# Altium schematic sheet Battery-Management.SchDoc
size A3; SheetNumber: 2; SheetTotal: 2
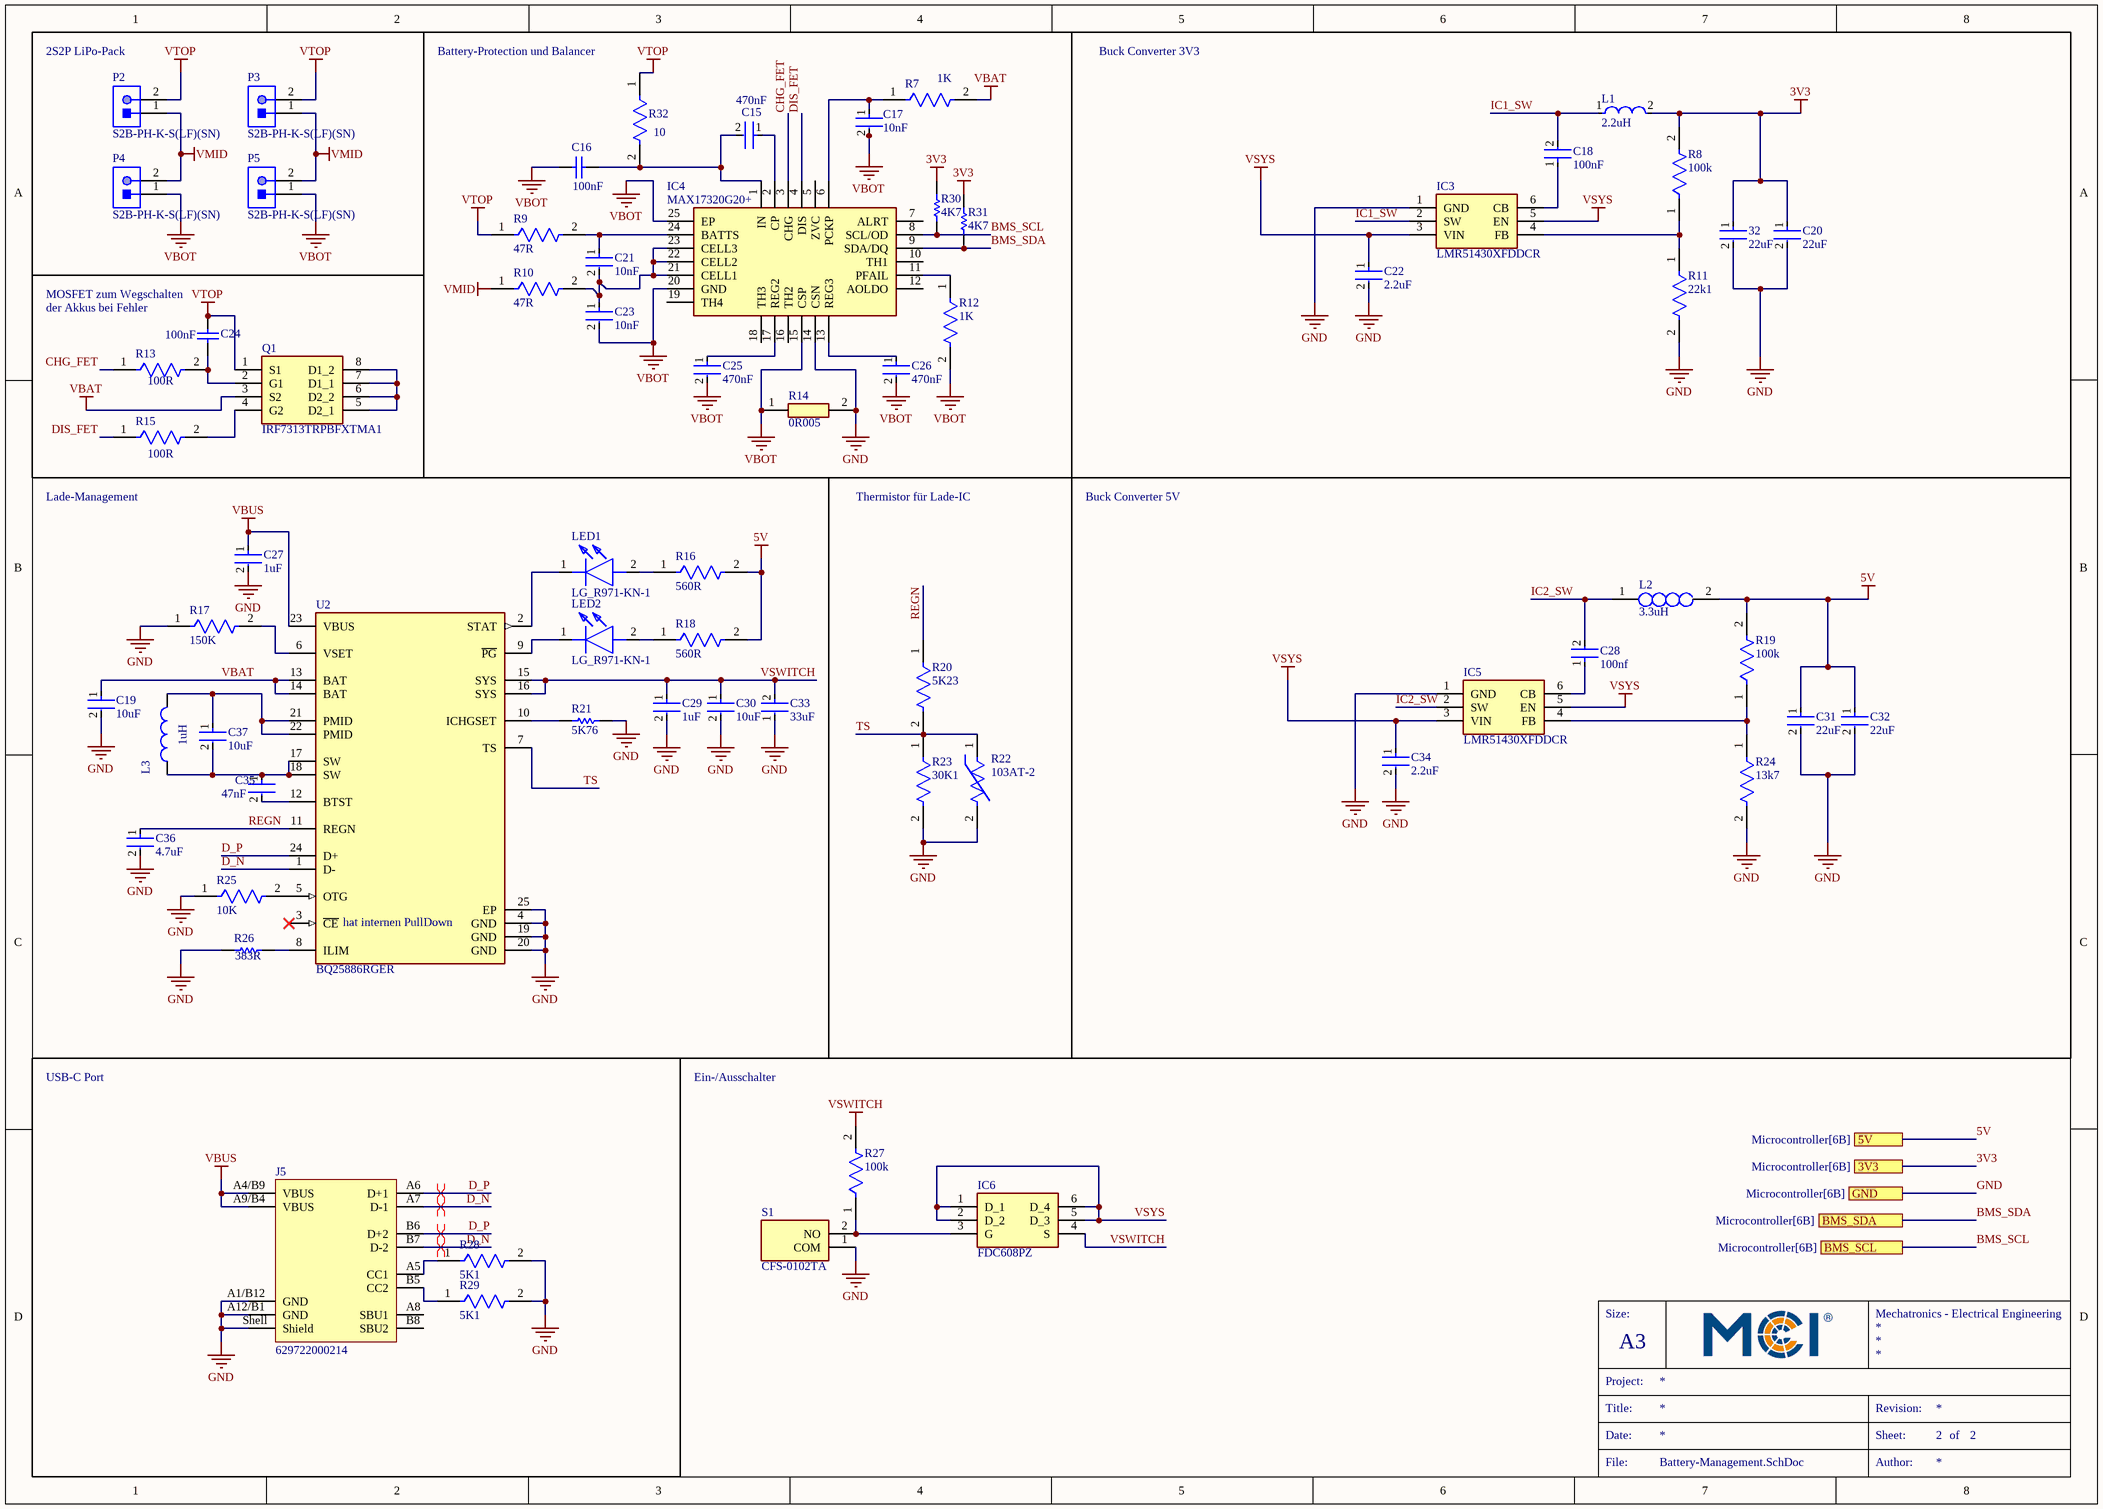
[diagram p0: Battery-Management.SchDoc]

## Parts
32  22uF  [FP-C1210C226K4RACTU-MFG]
C15  470nF  [FP-C0805C-DN-MFG]
C16  100nF  [CAPC2013X145X50LL20T20]
C17  10nF  [FP-AC0805-0_85-MFG]
C18  100nF  [FP-C0805C104M5UACTU-MFG]
C19  10uF  [FP-GRM21B-0_15-IPC_A]
C20  22uF  [FP-C1210C226K4RACTU-MFG]
C21  10nF  [FP-AC0805-0_85-MFG]
C22  2.2uF  [FP-CC1210-G3-MFG]
C23  10nF  [FP-AC0805-0_85-MFG]
C24  100nF  [CAPC2013X145X50LL20T20]
C25  470nF  [FP-C0805C-DN-MFG]
C26  470nF  [FP-C0805C-DN-MFG]
C27  1uF  [FP-CGA4J-MFG]
C28  100nf  [FP-C0805C104M5UACTU-MFG]
C29  1uF  [FP-CGA4J-MFG]
C30  10uF  [FP-C0805C-DG-MFG]
C31  22uF  [FP-C1210C226K4RACTU-MFG]
C32  22uF  [FP-C1210C226K4RACTU-MFG]
C33  33uF  [FP-KRM55Q-6_1_5_3_3_9_1_2-MFG]
C34  2.2uF  [FP-CC1210-G3-MFG]
C35  47nF  [FP-C1206C-EB-MFG]
C36  4.7uF  [FP-C0805C475K3RACAUTO-MFG]
C37  10uF  [FP-GRM21B-0_15-IPC_A]
IC3  LMR51430XFDDCR  [SOT95P280X110-6N]
IC4  MAX17320G20+  [QFN50P400X400X80-25N]
IC5  LMR51430XFDDCR  [SOT95P280X110-6N]
IC6  FDC608PZ  [SOT95P275X110-6N]
J5  629722000214  [629722000214]
L1  2.2uH  [FP-IHLP-2020BZ-FP_1_905x2-MFG]
L2  3.3uH  [INDPM6054X300N]
L3  1uH  [WE-PMFI_322512]
LED1  LG_R971-KN-1  [LEDC2012X80N]
LED2  LG_R971-KN-1  [LEDC2012X80N]
P2  S2B-PH-K-S(LF)(SN)  [JST-S2B-PH-K-S_V]
P3  S2B-PH-K-S(LF)(SN)  [JST-S2B-PH-K-S_V]
P4  S2B-PH-K-S(LF)(SN)  [JST-S2B-PH-K-S_V]
P5  S2B-PH-K-S(LF)(SN)  [JST-S2B-PH-K-S_V]
Q1  IRF7313TRPBFXTMA1  [SOIC127P600X175-8N]
R7  1K  [FP-PCAN0805-MFG]
R8  100k  [FP-RQ73C2A-IPC_B]
R9  47R  [FP-CRGP1206-IPC_C]
R10  47R  [FP-CRGP1206-IPC_C]
R11  22k1  [FP-RT0805-MFG]
R12  1K  [FP-PCAN0805-MFG]
R13  100R  [FP-RN73R2A-IPC_A]
R14  0R005  [RESC7146X175N]
R15  100R  [FP-RN73R2A-IPC_A]
R16  560R  [FP-RMCF0805-IPC_A]
R17  150K  [FP-RK73H2A-IPC_B]
R18  560R  [FP-RMCF0805-IPC_A]
R19  100k  [FP-RQ73C2A-IPC_B]
R20  5K23  [FP-RP73P-2A-MFG]
R21  5K76  [RESC2013X60X35ML10T20]
R22  103AT-2  [FP-103AT-2-MFG]
R23  30K1  [FP-MCU0805-IPC_C]
R24  13k7  [FP-RT0805-MFG]
R25  10K  [FP-AT0805-MFG]
R26  383R  [RESC2013X60X35LL10T20]
R27  100k  [FP-RQ73C2A-IPC_B]
R28  5K1  [FP-AC0805-MFG]
R29  5K1  [FP-AC0805-MFG]
R30  4K7  [RESC2013X60X35NL10T20]
R31  4K7  [RESC2013X60X35NL10T20]
R32  10  [FP-RT0805-MFG]
S1  CFS-0102TA  [CFS0102TA]
U2  BQ25886RGER  [FP-RGE0024H-IPC_C]

## Ports
3V3 (see Microcontroller[6B]), 5V (see Microcontroller[6B]), BMS_SCL (see Microcontroller[6B]), BMS_SDA (see Microcontroller[6B]), GND (see Microcontroller[6B])

## Nets
3V3: 32.1 C20.1 L1.2 R8.2 R30.2 R31.2 ; port 3V3
5V: C31.1 C32.1 L2.2 R16.2 R18.2 R19.2 ; port 5V
GND: 32.2 C19.2 C20.2 C22.2 C27.2 C29.2 C30.2 C31.2 C32.2 C33.1 C34.2 C36.2 IC3.1(GND) IC4.14(CSN) IC5.1(GND) J5.A1/B12(GND) J5.A12/B1(GND) J5.Shell(Shield) R11.2 R14.2 R17.1 R21.2 R22.2 R23.2 R24.2 R25.1 R26.1 R28.2 R29.2 S1.1(COM) U2.4(GND) U2.19(GND) U2.20(GND) U2.25(EP) ; port GND
VBAT: C19.1 Q1.3(S2) R7.2 U2.13(BAT) U2.14(BAT)
VBOT: C16.1 C17.2 C23.2 C25.2 C26.2 IC4.15(CSP) IC4.20(GND) IC4.25(EP) P4.1 P5.1 R12.2 R14.1
VBUS: C27.1 J5.A4/B9(VBUS) J5.A9/B4(VBUS) U2.23(VBUS)
VMID: P2.1 P3.1 P4.2 P5.2 R10.1
VSWITCH: C29.1 C30.1 C33.2 IC6.4(S) R27.2 U2.15(SYS) U2.16(SYS)
VSYS: C22.1 C34.1 IC3.3(VIN) IC3.5(EN) IC5.3(VIN) IC5.5(EN) IC6.1(D_1) IC6.2(D_2) IC6.5(D_3) IC6.6(D_4)
VTOP: C24.2 P2.2 P3.2 Q1.1(S1) R9.1 R32.1
BMS_SCL: IC4.8(SCL/OD) R30.1 ; port BMS_SCL
BMS_SDA: IC4.9(SDA/DQ) R31.1 ; port BMS_SDA
CHG_FET: IC4.3(CHG) R13.1
D_N: J5.A7(D-1) J5.B7(D-2) U2.1(D-)
D_P: J5.A6(D+1) J5.B6(D+2) U2.24(D+)
DIS_FET: IC4.4(DIS) R15.1
IC1_SW: C18.2 IC3.2(SW) L1.1
IC2_SW: C28.2 IC5.2(SW) L2.1
REGN: C36.1 R20.1 U2.11(REGN)
TS: R20.2 R22.1 R23.1 U2.7(TS)
NetC15_1: C15.1 IC4.2(CP)
NetC15_2: C15.2 C16.2 IC4.1(IN) R32.2
NetC17_1: C17.1 IC4.6(PCKP) R7.1
NetC18_1: C18.1 IC3.6(CB)
NetC21_1: C21.1 IC4.24(BATTS) R9.2
NetC21_2: C21.2 C23.1 IC4.21(CELL1) IC4.22(CELL2) IC4.23(CELL3) R10.2
NetC24_1: C24.1 Q1.2(G1) R13.2
NetC25_1: C25.1 IC4.17(REG2)
NetC26_1: C26.1 IC4.13(REG3)
NetC28_1: C28.1 IC5.6(CB)
NetC35_1: C35.1 C37.2 L3.1 U2.17(SW) U2.18(SW)
NetC35_2: C35.2 U2.12(BTST)
NetC37_1: C37.1 L3.2 U2.21(PMID) U2.22(PMID)
NetIC3_4: IC3.4(FB) R8.1 R11.1
NetIC4_11: IC4.11(PFAIL) R12.1
NetIC5_4: IC5.4(FB) R19.1 R24.1
NetIC6_3: IC6.3(G) R27.1 S1.2(NO)
NetJ5_A5: J5.A5(CC1) R28.1
NetJ5_B5: J5.B5(CC2) R29.1
NetLED1_1: LED1.1(K) U2.2(STAT)
NetLED1_2: LED1.2(A) R16.1
NetLED2_1: LED2.1(K) U2.9(~{PG})
NetLED2_2: LED2.2(A) R18.1
NetQ1_4: Q1.4(G2) R15.2
NetQ1_5: Q1.5(D2_1) Q1.6(D2_2) Q1.7(D1_1) Q1.8(D1_2)
NetR17_2: R17.2 U2.6(VSET)
NetR21_1: R21.1 U2.10(ICHGSET)
NetR25_2: R25.2 U2.5(OTG)
NetR26_2: R26.2 U2.8(ILIM)

Not connected (* = marked no-connect by the designer): IC4 5(ZVC) 7(ALRT) 10(TH1) 12(AOLDO) 16(TH2) 18(TH3) 19(TH4); J5 A8(SBU1) B8(SBU2); U2 3(~{CE})*

## Layout directives
differential pair: D_N, D_P

## Notes on the sheet
- (near P2) 2S2P LiPo-Pack
- (near R32) Battery-Protection und Balancer
- Buck Converter 3V3
- (near C24) MOSFET zum Wegschalten
- der Akkus bei Fehler
- Lade-Management
- Thermistor für Lade-IC
- Buck Converter 5V
- (near U2) hat internen PullDown
- USB-C Port
- Ein-/Ausschalter
- Size:
- Mechatronics - Electrical Engineering
- Project:
- A3
- Title:
- Date:
- Revision:
- Sheet:
- of
- File:
- Author:

## Library data of the parts
32 C20 C31 C32 = CMP-03020-034651-1: CAP CER 22UF 16V X7R 1210; Dielectric Material: Ceramic; Tolerance: 10%; Dissipation Factor: 5%; Case Code (Imperial): 1210; Capacitance: 22uF; Height: 2.5mm; Termination: SMD/SMT; Package Quantity: 1000; Voltage Rating (DC): 16V; Voltage: 16V; Depth: 2.5mm; Case Code (Metric): 3225; Mount: Surface Mount; Packaging: Cut Tape; Dielectric: X7R; Length: 3.2mm; REACH SVHC: No SVHC; Case/Package: 1210; Min Operating Temperature: -55°C; Voltage Rating: 16V; Max Operating Temperature: 125°C; Weight: 0.000564oz; Width: 0.098inch; Thickness: 0.11inch
C15 C25 C26 = CMP-03020-021882-1: CAP CER 0.47UF 25V X7R 0805; Manufacturer: KEMET; Manufacturer Part Number: C0805C474J3RACAUTO; Value: 0.47 μF; Tolerance: 0.05; Material: Ceramic; Temperature Coefficient: 30ppm/°C; Temperature Characteristic: X7R; Temperature: -55°C to +125°C; Category: Cap; Temperature Range Low: -55°C; Ipc Land Pattern Name: CAPC200125X78; Temperature Range High: +125°C; Device Class L2: Capacitors; ComponentLink2URL: https://content.kemet.com/datasheets/KEM_C1003_C0G_SMD.pdf; Height: 0.88mm; Package: C0805C-DN; Device Class L1: Passive Components; Capacitance: 0.47 μF; Lead Free: Yes; Octopart: https://octopart.com/c0805c474j3racauto-kemet-20760776; Device Class L3: Ceramic Capacitors; Automotive: No; ComponentLink2Description: Datasheet; Voltage Rating: 25 V; Digikey Description: CAP CER 0.47UF 25V X7R 0805; RoHS: TRUE
C16 C24 = CMP-2007-01396-1: Part Number: VJ0805Y104JXXPW1BC; Manufacturer: Vitramon
C17 C21 C23 = CMP-03422-000545-1: AC Series 0805 10 nF 100 V ±10% X7R Multilayer Ceramic Capacitor; Manufacturer: Yageo; Manufacturer Part Number: AC0805KRX7R0BB103; Temperature Coefficient: 15%; Automotive Grade: Grade 1; Tolerance: 0.1; Voltage Rating: 100 V; Capacitance: 10 nF; Lead Free: Yes; RoHS: TRUE; Temperature Range Low: -55°C; ComponentLink2URL: http://www.yageo.com/documents/recent/UPY-AC_NP0X7R_16V-to-630V_12.pdf; Ipc Land Pattern Name: CAPC200125X85; Footprint Url: http://www.yageo.com/exep/pages/download/literatures/UPY-C_GEN_24.pdf; Octopart: https://octopart.com/ac0805krx7r0bb103-yageo-75656636; Temperature Characteristic: X7R; Value: 10 nF; Device Class L2: Capacitors; Package: AC0805-0.85; Device Class L1: Passive Components; Category: Cap; Temperature: -55°C to +125°C; ComponentLink2Description: Datasheet; Mouser Description: AC Series 0805 10 nF 100 V ±10% X7R Multilayer Ceramic Capacitor; Automotive: Yes; Digikey Description: AC Series 0805 10 nF 100 V ±10% X7R Multilayer Ceramic Capacitor; Device Class L3: Ceramic Capacitors; Material: Ceramic; Temperature Range High: +125°C; Height: 0.95mm
C18 C28 = CMP-2007-03742-2: CAP CER 0.1UF 50V Z5U 0805; Dielectric Material: Ceramic; Tolerance: 20%; Dissipation Factor: 4%; Height: 0.78mm; Dielectric: Z5U; REACH SVHC: No SVHC; Min Operating Temperature: 10°C; Lead Pitch: 0.75mm; Construction: Flat; Mount: Surface Mount; Max Operating Temperature: 85°C; RoHS Compliant: Yes; Width: 1.2mm; Contact Plating: Tin; Thickness: 0.035inch; Series: C; Capacitance: 100nF; Packaging: Tape and Reel; Package Quantity: 1; Voltage Rating (DC): 50V; Termination: SMD/SMT; Voltage: 50V; Case Code (Metric): 2012; Depth: 1.25mm; Radiation Hardening: No; Case/Package: 0805; Length: 2mm; Case Code (Imperial): 0805; Voltage Rating: 50V; Number of Pins: 2; Lead Free: Lead Free
C19 C37 = CMP-06035-013048-1: Chip Multilayer Ceramic Capacitors for General Purpose, 0805, 10uF, X5R, 15%, 20%, 25V; Max Operating Temperature: 85°C; Package Quantity: 3000; Case/Package: 0805; Depth: 1.25mm; Case Code (Imperial): 0805; Termination: SMD/SMT; Width: 0.049inch; Packaging: Tape and Reel; Tolerance: 20%; Height: 1.25mm; Min Operating Temperature: -55°C; Capacitance: 10uF; Weight: 0.000335oz; Voltage Rating (DC): 25V; Dielectric: X5R; Length: 2mm; Thickness: 0.055inch; Voltage Rating: 25V; Resistor Type: Ceramic; Lead Free: Lead Free; Case Code (Metric): 2012; Mount: Surface Mount; REACH SVHC: No SVHC
C22 C34 = CMP-03422-001503-1: CAP CER 1210; Dielectric: X7R; Tolerance: 10%; Depth: 2.5mm; Max Operating Temperature: 125°C; Capacitance: 2.2uF; RoHS Compliant: Yes; Length: 3.2mm; Min Operating Temperature: -55°C; Case/Package: 1210; Packaging: Tape and Reel
C27 C29 = CMP-08246-006910-1: Cap Ceramic 1uF 16V X7R 10% Pad SMD 0805 +125°C Automotive T/R; Package Quantity: 2000; Min Operating Temperature: -55°C; Dielectric: X7R; Height: 1.25mm; Voltage Rating (DC): 16V; Thickness: 0.049inch; Case Code (Metric): 2012; Mount: Surface Mount; Width: 0.049inch; Case/Package: 0805; Voltage Rating: 16V; Packaging: Tape and Reel; Capacitance: 1uF; RoHS Compliant: Yes; Length: 0.079inch; Ratings: AEC-Q200; Max Operating Temperature: 125°C; Weight: 0.000194oz; Series: CGA; Case Code (Imperial): 0805; Tolerance: 10%
C30 = CMP-2007-03243-2: CAP CER 10UF 10V X5R 0805; Manufacturer Part Number: C0805C106K8PACTU; Manufacturer: Kemet; 3DS Part Number: 220-00001; Tolerance: 10%; Description: SMD Comm X5R, Ceramic, 10 uF, 10%, 10 V, X5R, SMD, MLCC, Temperature Stable, Class II, 0805; Temperature Coefficient: 15%; Material: Ceramic; Device Class L2: Capacitors; Device Class L1: Passive Components; ComponentLink2URL: https://content.kemet.com/datasheets/KEM_C1006_X5R_SMD.pdf; Height: 1.4mm; Lead Free: Yes; Digikey Description: CAP CER 10UF 10V X5R 0805; Octopart: https://octopart.com/c0805c106k8pactu-kemet-98697; Capacitance: 10uF; Value: 10uF; Temperature Range Low: -55°C; Temperature: -55°C to +85°C; Automotive: No; Mouser Description: CAP CER 10UF 10V X5R 0805; Ipc Land Pattern Name: CAPC200125X125; Temperature Range High: +85°C; Voltage: 10V; RoHS: TRUE; Device Class L3: Ceramic Capacitors; ComponentLink2Description: Datasheet; Voltage Rating: 10V; Package: C0805C-DG; Temperature Characteristic: X5R; Category: Cap
C33 = CMP-06035-051390-1: Cap Ceramic 33uF 25V X7R ±10% SMD 2220 +125°C Emboss T/R
C35 = CMP-03020-010277-1: CAP CER 0.047UF 50V X8R 1206; Manufacturer: KEMET; Manufacturer Part Number: C1206C473K5HACTU; Temperature Coefficient: 15%; Value: 47,000 pF; Tolerance: 0.1; Automotive Grade: Grade 0; Material: Ceramic; Mouser Description: Multilayer Ceramic Capacitors MLCC - SMD/SMT 50V 47000pF +/-10% X8R; Temperature: -55°C to +150°C; Digikey Description: CAP CER 0.047UF 50V X8R 1206; Package: C1206C-EB; Automotive: Yes; Category: Cap; ComponentLink2Description: Datasheet; Capacitance: 47,000 pF; Device Class L3: Ceramic Capacitors; ComponentLink2URL: https://content.kemet.com/datasheets/KEM_C1007_X8R_ULTRA_150C_SMD.pdf; Device Class L1: Passive Components; Temperature Range Low: -55°C; Device Class L2: Capacitors; RoHS: TRUE; Voltage Rating: 50 V; Octopart: https://octopart.com/c1206c473k5hactu-kemet-12793246; Temperature Range High: +150°C; Ipc Land Pattern Name: CAPC320160X78; Lead Free: Yes; Temperature Characteristic: X8R; Height: 0.88mm
C36 = CMP-03020-034682-1: CAP CER 0805 4.7UF 25V X7R  10%; RoHS Compliant: Yes
IC3 IC5 = LMR51430XFDDCR: Integrated Circuit; Manufacturer_Name: Texas Instruments; Datasheet Link: https://www.ti.com/lit/ds/symlink/lmr51420.pdf?ts=1651317966125; Height: 1.1mm; Manufacturer_Part_Number: LMR51430XFDDCR; Mouser Part Number: 595-LMR51430XFDDCR; Mouser Price/Stock: https://www.mouser.co.uk/ProductDetail/Texas-Instruments/LMR51430XFDDCR?qs=vvQtp7zwQdOoH7ISqkGKmw%3D%3D; Arrow Part Number: LMR51430XFDDCR; Arrow Price/Stock: https://www.arrow.com/en/products/lmr51430xfddcr/texas-instruments.html?utm_currency=USD&region=nac
IC4 = MAX17320G20+: Integrated Circuit; Manufacturer_Name: Analog Devices; Datasheet Link: https://www.analog.com/MAX17320/datasheet; Height: 0.8mm; Manufacturer_Part_Number: MAX17320G20+; Mouser Part Number: 700-MAX17320G20+; Mouser Price/Stock: https://www.mouser.co.uk/ProductDetail/Analog-Devices-Maxim-Integrated/MAX17320G20%2b?qs=sPbYRqrBIVnSGVqLjzq7LQ%3D%3D; Arrow Part Number: MAX17320G20+; Arrow Price/Stock: https://www.arrow.com/en/products/max17320g20/analog-devices?utm_currency=USD&region=nac
IC6 = FDC608PZ: Integrated Circuit; Manufacturer_Name: onsemi; Datasheet Link: https://www.onsemi.com/pub/Collateral/FDC608PZ-D.PDF; Height: 1.1mm; Manufacturer_Part_Number: FDC608PZ; Mouser Part Number: 512-FDC608PZ; Mouser Price/Stock: https://www.mouser.co.uk/ProductDetail/onsemi-Fairchild/FDC608PZ?qs=cunaKtMgX5PRvFzPztrrbg%3D%3D; Arrow Part Number: FDC608PZ; Arrow Price/Stock: https://www.arrow.com/en/products/fdc608pz/on-semiconductor?utm_currency=USD&region=nac
J5 = CMP-207978-000003-3: Usb Conn, R/a, Type C 2.0, Rcpt, 16POS Rohs Compliant: Yes; Number of Contacts: 12; Current Rating: 5A; Insulation Resistance: 100MΩ; USB Standard: USB 2.0; Voltage Rating: 20V; Gender: Receptacle; Pin Length: 950µm; Max Operating Temperature: 85°C; Number of Pins: 16; Height: 3.51mm; Contact Material: Gold, Nickel; Packaging: Tape and Reel; RoHS: Compliant; Min Operating Temperature: -40°C
L1 = CMP-02424-000260-1: Fixed Inductors Commercial Low DCR Series 2.2uH 5A 37.7mΩ 20%; Test Frequency: 100kHz; Self Resonant Frequency: 41MHz; Shielding: Shielded; Saturation Current: 5.5A; DC Resistance (DCR): 37.7mR; Core Material: Metal; RMS Current (Irms): 5A; Case/Package: 2020; Width: 0.204inch; Inductance: 2.2uH; Height - Seated (Max): 0.079inch; Package Quantity: 2000; Length: 5.74mm; Inductance Tolerance: 20%; Tolerance: 20%; Height: 2mm; Min Operating Temperature: -55°C; Termination: SMD/SMT; Current Rating: 5A; Mount: Surface Mount; Max DC Current: 5.5A; Packaging: Tape and Reel; Number of Pins: 2; Max Operating Temperature: 125°C; Depth: 5.43mm; Military Standard: Not; Radiation Hardening: No; Contact Plating: Tin; Lead Free: Lead Free
L2 = PA4340.332NLT: Inductor; Manufacturer_Name: Yageo Group; Datasheet Link: https://www.arrow.com/en/products/pa4340.332nlt/pulse-electronics-corporation; Height: 3mm; Manufacturer_Part_Number: PA4340.332NLT; Mouser Part Number: 673-PA4340.332NLT; Mouser Price/Stock: https://www.mouser.co.uk/ProductDetail/Pulse-Electronics/PA4340332NLT?qs=%2FzQKu7YvIMZ40DmrCvsoMQ%3D%3D; Arrow Part Number: PA4340.332NLT; Arrow Price/Stock: https://www.arrow.com/en/products/pa4340.332nlt/pulse-electronics-corporation?utm_currency=USD&region=europe
L3 = CMP-03913-162350127-1: Power Ind, 1UH, 5.8A, Shielded, 1210 Rohs Compliant: Yes
LED1 LED2 = LG_R971-KN-1: LED; Manufacturer_Name: ams OSRAM; Manufacturer_Part_Number: LG R971-KN-1; Datasheet Link: http://www.mouser.com/ds/2/311/LG R971 - CHIPLED 0805-318376.pdf; Height: 0.8mm; Mouser Part Number: 720-LGR971-KN-1; Mouser Price/Stock: https://www.mouser.co.uk/ProductDetail/ams-OSRAM/LG-R971-KN-1?qs=LsPilcdHE7EX1EB7GCLHxg%3D%3D; Arrow Part Number: LG R971-KN-1; Arrow Price/Stock: https://www.arrow.com/en/products/lgr971-kn-1/osram-opto-semiconductors
P2-P5 = CMP-1755-00004-1: Male Header, Pitch 2 mm, 1 x 2 Position, Height 4.8 mm, Tail Length 3.4 mm, -25 to 85 degC, RoHS, Bulk; Case\Package: Radial; Tolerance: 20%; Capacitance: 10 uF; Voltage Rating (DC): 50 V; Packaging: Bulk; ComponentLink1URL: http://www.jst-mfg.com/product/pdf/eng/ePH.pdf; Radiation Hardening: No; Height: 11 mm; Package Quantity: 200; PackageDescription: Male Header, Pitch 2 mm, 1 x 2 Position, Height 4.8 mm, Tail Length 3.4 mm; PackageReference: S2B-PH-K-S; Diameter: 5 mm; Pins: 2; Mount: Through Hole; Max Operating Temperature: 85 degC; Min Operating Temperature: -40 degC; ComponentLink1Description: Datasheet; DatasheetVersion: Dec-12; Length: 11 mm; Lead Pitch: 2 mm; REACH SVHC: No SVHC; Voltage Rating: 50 V; RoHSCompliant: true
Q1 = IRF7313TRPBFXTMA1: MOSFET (N-Channel); Manufacturer_Name: Infineon; Datasheet Link: https://www.mouser.co.uk/datasheet/2/196/Infineon_IRF7313_DataSheet_v01_01_EN-3224007.pdf; Height: 1.75mm; Manufacturer_Part_Number: IRF7313TRPBFXTMA1; Mouser Part Number: 726-IRF7313TRPBFXTMA; Mouser Price/Stock: https://www.mouser.co.uk/ProductDetail/Infineon-Technologies/IRF7313TRPBFXTMA1?qs=1Kr7Jg1SGW%2FUB%252Bqt0Ezjig%3D%3D; Arrow Part Number: IRF7313TRPBFXTMA1; Arrow Price/Stock: https://www.arrow.com/en/products/irf7313trpbfxtma1/infineon-technologies-ag?utm_currency=USD&region=nac
R7 R12 = CMP-02407-000038-1: RES SMD 1K OHM 0.1% 1W 0805; Manufacturer Part Number: PCAN0805E1001BST5; Manufacturer: Vishay; Resistance: 1kΩ; Voltage Rating: 100V; Temperature Coefficient: 25ppm/°C; Value: 1kΩ; Power Rating: 1W; Tolerance: 0.1%; Temperature: -55°C to +155°C; Digikey Description: RES SMD 1K OHM 0.1% 1W 0805; Height: 0.018inch; RoHS: TRUE; Temperature Range Low: -55°C; ComponentLink2Description: Datasheet; Ipc Land Pattern Name: RESC203127X38; Composition: Thin Film; ComponentLink2URL: https://www.vishay.com/docs/60125/pcan.pdf; Lead Free: Yes; Octopart: https://octopart.com/pcan0805e1001bst5-vishay-73274806; Device Class L3: Chip SMD Resistors; Package: PCAN0805; Series: PCAN; Temperature Range High: +155°C; Device Class L1: Passive Components; Automotive: No; Category: Res; Device Class L2: Resistors
R8 R19 R27 = CMP-03211-011351-1: RQ73 0805 100KΩ 0.2W 10ppm/°C 0.1% 100V
R9 R10 = CMP-03211-007286-1: CRGP1206 47Ω 0.5W ±100ppm/°C 1% 200V; Manufacturer Part Number: CRGP1206F47R; Manufacturer: TE; Tolerance: 0.01; RoHS: TRUE; Value: 47Ω; Voltage Rating: 200V; Temperature: -55°C to +155°C; Mouser Description: SMD Precision Pulse Thick Film Chip Resistor; Temperature Coefficient: ±100ppm/°C; Power Rating: 0.5W; Device Class L1: Passive Components; Ipc Land Pattern Name: RESC310155X55; Composition: Thick Film; ComponentLink2URL: https://www.mouser.com/datasheet/2/418/NG_DS_9-1773463-9_A-1358566.pdf; Ambient Temperature Range High: +70°C; Lead Free: Yes; Temperature Range Low: -55°C; Resistance: 47Ω; Octopart: https://octopart.com/crgp1206f47r-te+connectivity-91018885; Temperature Range High: +155°C; Automotive: No; Height: 0.65mm; Device Class L2: Resistors; Package: CRGP1206; Category: Res; ComponentLink2Description: Datasheet; Device Class L3: Chip SMD Resistors; Series: CRGP
R11 = CMP-2001-01692-2: RES SMD 22.1K OHM 0.1% 1/8W 0805; Manufacturer Part Number: RT0805BRD0722K1L; Manufacturer: Yageo; Temperature Coefficient: 25 ppm/°C; Voltage Rating: 150V; Tolerance: 0.0025; Resistance: 22.1KΩ; Value: 22.1KΩ; Power Rating: 0.125W; Lead Free: Yes; Series: RT; Digikey Description: RES SMD 22.1K OHM 0.1% 1/8W 0805; Mouser Description: Thin Film Resistors - SMD 1/8W 22.1K ohm .1% 25ppm; Device Class L3: Chip SMD Resistors; ComponentLink2URL: http://www.yageo.com/documents/recent/PYu-RT_1-to-0.01_RoHS_L_9.pdf; Octopart: https://octopart.com/rt0805brd0722k1l-yageo-1447960; ComponentLink2Description: Datasheet; Temperature Range High: +155°C; Height: 0.6mm; Composition: Thin Film; Temperature Range Low: -55°C; RoHS: TRUE; Device Class L2: Resistors; Automotive: No; Ipc Land Pattern Name: RESC200125X50; Device Class L1: Passive Components; Temperature: -55°C to +155°C; Category: Res; Package: RT0805; Footprint Url: http://www.yageo.com/exep/pages/download/literatures/PYu-R_Mount_10.pdf
R13 R15 = CMP-04015-040511-1: 100Ω ±0.1% 0.125W, 1/8W Chip Resistor 0805 (2012 Metric) Moisture Resistant Thin Film
R14 = WSHP28185L000FEA: Resistor; Manufacturer_Name: Vishay; Datasheet Link: https://componentsearchengine.com/Datasheets/1/WSHP28185L000FEA.pdf; Height: 1.75mm; Manufacturer_Part_Number: WSHP28185L000FEA; Mouser Part Number: 71-WSHP28185L000FEA; Mouser Price/Stock: https://www.mouser.co.uk/ProductDetail/Vishay-Dale/WSHP28185L000FEA?qs=WY0B%252Bpw29jOU8WmnTnxtZg%3D%3D; Arrow Part Number: WSHP28185L000FEA; Arrow Price/Stock: https://www.arrow.com/en/products/wshp28185l000fea/vishay?utm_currency=USD&region=nac
R16 R18 = CMP-26527-006895-1: 560Ω ±5% 0.125W 0805 Thick Film Chip Resistor AEC-Q200 compliant; Temperature Coefficient: 200ppm/°C; Max Power Dissipation: 125mW; Resistance: 560R; RoHS Compliant: Yes; Military Standard: Not; Case Code (Imperial): 0805; Length: 0.079inch; Mount: Surface Mount; Height: 0.026inch; Max Operating Temperature: 155°C; Resistor Type: Thick Film; Tolerance: 5%; Series: RMCF; Radiation Hardening: No; Min Operating Temperature: -55°C; Lead Free: Lead Free; Construction: Rectangular; Case Code (Metric): 2012; Case/Package: 0805; Features: Automotive AEC-Q200; Packaging: Tape and Reel; Contact Plating: Tin; Depth: 1.25mm; Width: 0.049inch; Number of Terminations: 2
R17 = CMP-04015-107892-1: 150kΩ ±1% 0.25W Chip Resistor 0805 Thick Film AEC-Q200 Qualified; Resistance: 150kR; Power Rating: 125mW; Voltage Rating: 150V; Temperature Coefficient: 100ppm/°C; Tolerance: 1%; Series: RK73H; Max Operating Temperature: 155°C; Min Operating Temperature: -55°C; Termination: SMD/SMT; Case/Package: 0805; Lead Free: Lead Free; Case Code (Imperial): 0805; Packaging: Tape and Reel; Voltage Rating (DC): 150V; RoHS Compliant: Yes; Case Code (Metric): 2012
R20 = CMP-03211-002209-1: RP73P 0805 5.23KΩ 0.25W 25ppm/°C 0.10% 150V; Manufacturer: TE Connectivity; Manufacturer Part Number: RP73PF2A5K23BTDF; Tolerance: 0.001; ComponentLink2URL: https://www.te.com/commerce/DocumentDelivery/DDEController?Action=srchrtrv&DocNm=1773272&DocType=DS&DocLang=English; Device Class L1: Passive Components; Device Class L2: Resistors; Lead Free: Yes; Temperature Range High: +155°C; Series: RP73P; Resistance: 5.23KΩ; ComponentLink2Description: Datasheet; Composition: Thin Film; Octopart: https://octopart.com/rp73pf2a5k23btdf-te+connectivity-45467027; Device Class L3: Chip SMD Resistors; Temperature Coefficient: 25ppm/°C; Category: Res; Temperature: -55°C to +155°C; Automotive: No; Temperature Range Low: -55°C; Package: RP73P-2A; Ipc Land Pattern Name: RESC200125X55; Voltage Rating: 150V; Power Rating: 0.25W; Height: 0.65mm; RoHS: TRUE; Value: 5.23KΩ
R21 = CMP-2001-01209-1: Part Number: RC0805FR-075K76L; Manufacturer: Yageo
R22 = CMP-2000-05824-2: Thermistor NTC 10KOhm 1% 2-Pin; Resistance: 10kR; Lead Pitch: 2.54mm; Height: 2.4mm; Max Operating Temperature: 110°C; Width: 3.7mm; RoHS Compliant: Yes; Min Operating Temperature: -50°C; Termination: Radial; Packaging: Bulk; Number of Pins: 2; Series: AT; Tolerance: 1%; Length: 17mm
R23 = CMP-02407-010493-1: RES 1.05K OHM 0.5% 1/5W 0805; Tolerance: 0.1%; Max Power Dissipation: 125mW; Resistance: 30.1kR; Temperature Coefficient: 25ppm/°C; Package Quantity: 1000; Military Standard: Not; Case/Package: 0805; Max Operating Temperature: 125°C; Number of Terminations: 2; Radiation Hardening: No; Composition: Thin Film; Lead Free: Lead Free; Height: 0.022inch; Min Operating Temperature: -55°C; Contact Plating: Tin; Length: 0.079inch; Width: 0.049inch; Depth: 1.25mm; Packaging: Tape and Reel
R24 = CMP-03412-025952-1: RES 13.7K OHM 1/8W .1% SMD 0805; Manufacturer Part Number: RT0805BRD0713K7L; Manufacturer: Yageo; Power Rating: 0.125W; Tolerance: 0.0025; Value: 13.7KΩ; Voltage Rating: 150V; Temperature Coefficient: 25 ppm/°C; Device Class L3: Chip SMD Resistors; Temperature Range High: +155°C; Digikey Description: RES 13.7K OHM 1/8W .1% SMD 0805; ComponentLink2Description: Datasheet; Package: RT0805; RoHS: TRUE; ComponentLink2URL: http://www.yageo.com/documents/recent/PYu-RT_1-to-0.01_RoHS_L_9.pdf; Automotive: No; Lead Free: Yes; Device Class L1: Passive Components; Temperature: -55°C to +155°C; Category: Res; Ipc Land Pattern Name: RESC200125X50; Octopart: https://octopart.com/rt0805brd0713k7l-yageo-1409410; Height: 0.6mm; Resistance: 13.7KΩ; Footprint Url: http://www.yageo.com/exep/pages/download/literatures/PYu-R_Mount_10.pdf; Series: RT; Temperature Range Low: -55°C; Composition: Thin Film; Mouser Description: Thin Film Resistors - SMD 1/8W 13.7K ohm .1% 25ppm; Device Class L2: Resistors
R25 = CMP-03412-049031-1: Thin Film Chip Resistors Automotive Grade 10kΩ 0.5% 50ppm/°C 0805; Max Power Dissipation: 125mW; Resistance: 10kR; Ratings: AEC-Q200; Length: 0.079inch; Temperature Coefficient: 50ppm/°C; Height: 0.024inch; Min Operating Temperature: -55°C; Case/Package: 0805; Tolerance: 0.5%; RoHS Compliant: Yes; Features: Moisture Resistant; Number of Terminations: 2; Max Operating Temperature: 155°C; Series: AT; Packaging: Tape and Reel; Width: 0.049inch; Resistor Type: Thin Film
R26 = CMP-2001-01108-1: Part Number: RC0805FR-07383RL; Manufacturer: Yageo
R28 R29 = CMP-2001-04477-2: RES SMD 5.1K OHM 5% 1/8W 0805; Manufacturer: Yageo; Manufacturer Part Number: AC0805JR-075K1L; Automotive Grade: Grade 0; Value: 5.1KΩ; Voltage Rating: 150V; Tolerance: 0.05; Category: Res; RoHS: TRUE; Automotive: Yes; Device Class L1: Passive Components; Lead Free: Yes; Octopart: https://octopart.com/ac0805jr-075k1l-yageo-21711115; Series: AC; Temperature Range High: +155°C; ComponentLink2URL: http://www.yageo.com/documents/recent/PYu-AC_51_RoHS_L_6.pdf; Temperature Range Low: -55°C; ComponentLink2Description: Datasheet; Footprint Url: http://www.yageo.com/exep/pages/download/literatures/PYu-R_Mount_10.pdf; Mouser Description: Thick Film Resistors - SMD 5.1K ohm 5% 1/8W; Device Class L3: Chip SMD Resistors; Digikey Description: RES SMD 5.1K OHM 5% 1/8W 0805; Power Rating: 1/8W; Package: AC0805; Temperature: -55°C to +155°C; Device Class L2: Resistors; Resistance: 5.1KΩ; Height: 0.6mm; Ipc Land Pattern Name: RESC200125X50; Composition: Thick Film
R30 R31 = CMP-2001-01424-1: Manufacturer: Yageo; Part Number: RC0805JR-134K7L
R32 = CMP-03412-028725-1: RES SMD 10 OHM 1% 1/8W 0805; Manufacturer Part Number: RT0805FRE0710RL; Manufacturer: Yageo; Tolerance: 0.0001; Value: 10Ω; Temperature Coefficient: 50 ppm/°C; Voltage Rating: 150V; Power Rating: 0.125W; Package: RT0805; Lead Free: Yes; Series: RT; Footprint Url: http://www.yageo.com/exep/pages/download/literatures/PYu-R_Mount_10.pdf; Temperature Range High: +155°C; Temperature Range Low: -55°C; Octopart: https://octopart.com/rt0805fre0710rl-yageo-39855890; Height: 0.6mm; Device Class L1: Passive Components; Mouser Description: High Precision-High Stability Chip Resistor Thin Film 0805 10Ohm 1% Paper T/R; ComponentLink2URL: http://www.yageo.com/documents/recent/PYu-RT_1-to-0.01_RoHS_L_9.pdf; Device Class L2: Resistors; Composition: Thin Film; Device Class L3: Chip SMD Resistors; Automotive: No; RoHS: TRUE; Ipc Land Pattern Name: RESC200125X50; Temperature: -55°C to +155°C; ComponentLink2Description: Datasheet; Resistance: 10Ω; Category: Res; Digikey Description: RES SMD 10 OHM 1% 1/8W 0805
S1 = CFS-0102TA: Switch; Manufacturer_Name: Nidec Copal; Datasheet Link: https://www.mouser.at/datasheet/2/972/cfs-1628139.pdf; Height: 4.5mm; Manufacturer_Part_Number: CFS-0102TA; Mouser Part Number: 229-CFS-0102TA; Mouser Price/Stock: https://www.mouser.co.uk/ProductDetail/Nidec-Components/CFS-0102TA?qs=XeJtXLiO41Qa%2Fz7Gp%252BxLVg%3D%3D
U2 = CMP-04911-000046-1: PWR MGMT BATTERY MGMT